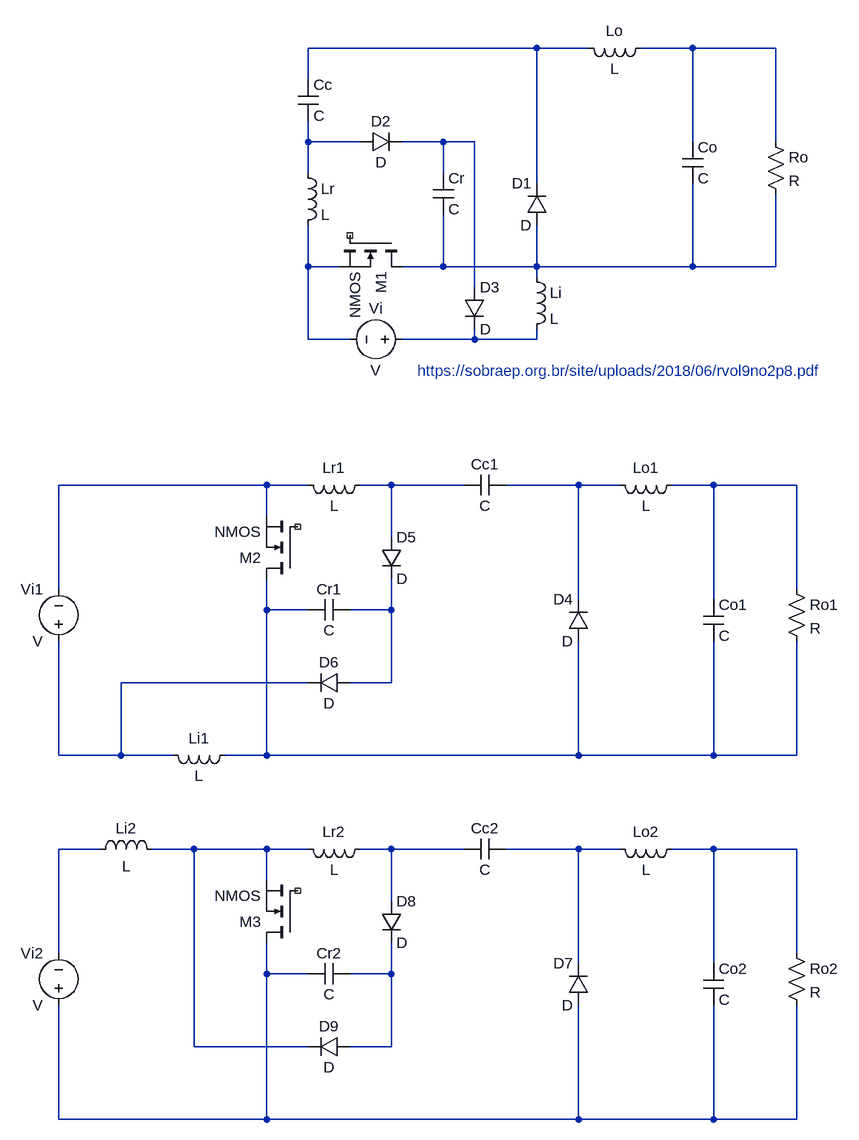
[diagram p0: schematic Draft1.asc]
Draft1.asc, the LTspice schematic file:
Version 4
SHEET 1 1072 1680
WIRE 480 -288 128 -288
WIRE 560 -288 480 -288
WIRE 720 -288 640 -288
WIRE 848 -288 720 -288
WIRE 128 -240 128 -288
WIRE 128 -144 128 -176
WIRE 208 -144 128 -144
WIRE 336 -144 272 -144
WIRE 384 -144 336 -144
WIRE 720 -144 720 -288
WIRE 848 -144 848 -288
WIRE 128 -96 128 -144
WIRE 336 -96 336 -144
WIRE 480 -80 480 -288
WIRE 128 48 128 -16
WIRE 176 48 128 48
WIRE 336 48 336 -32
WIRE 336 48 272 48
WIRE 480 48 480 -16
WIRE 480 48 336 48
WIRE 720 48 720 -80
WIRE 720 48 480 48
WIRE 848 48 848 -64
WIRE 848 48 720 48
WIRE 480 64 480 48
WIRE 384 80 384 -144
WIRE 128 160 128 48
WIRE 192 160 128 160
WIRE 384 160 384 144
WIRE 384 160 272 160
WIRE 480 160 480 144
WIRE 480 160 384 160
WIRE 64 384 -256 384
WIRE 128 384 64 384
WIRE 256 384 208 384
WIRE 368 384 256 384
WIRE 544 384 432 384
WIRE 608 384 544 384
WIRE 752 384 688 384
WIRE 880 384 752 384
WIRE 64 432 64 384
WIRE 256 464 256 384
WIRE -256 544 -256 384
WIRE 880 544 880 384
WIRE 544 560 544 384
WIRE 752 560 752 384
WIRE 64 576 64 528
WIRE 128 576 64 576
WIRE 256 576 256 528
WIRE 256 576 192 576
WIRE 128 688 -160 688
WIRE 256 688 256 576
WIRE 256 688 192 688
WIRE -256 800 -256 624
WIRE -160 800 -160 688
WIRE -160 800 -256 800
WIRE -80 800 -160 800
WIRE 64 800 64 576
WIRE 64 800 0 800
WIRE 544 800 544 624
WIRE 544 800 64 800
WIRE 752 800 752 624
WIRE 752 800 544 800
WIRE 880 800 880 624
WIRE 880 800 752 800
WIRE -192 944 -256 944
WIRE -48 944 -112 944
WIRE 64 944 -48 944
WIRE 128 944 64 944
WIRE 256 944 208 944
WIRE 368 944 256 944
WIRE 544 944 432 944
WIRE 608 944 544 944
WIRE 752 944 688 944
WIRE 880 944 752 944
WIRE 64 992 64 944
WIRE 256 1024 256 944
WIRE -256 1104 -256 944
WIRE 880 1104 880 944
WIRE 544 1120 544 944
WIRE 752 1120 752 944
WIRE 64 1136 64 1088
WIRE 128 1136 64 1136
WIRE 256 1136 256 1088
WIRE 256 1136 192 1136
WIRE -48 1248 -48 944
WIRE 128 1248 -48 1248
WIRE 256 1248 256 1136
WIRE 256 1248 192 1248
WIRE -256 1360 -256 1184
WIRE 64 1360 64 1136
WIRE 64 1360 -256 1360
WIRE 544 1360 544 1184
WIRE 544 1360 64 1360
WIRE 752 1360 752 1184
WIRE 752 1360 544 1360
WIRE 880 1360 880 1184
WIRE 880 1360 752 1360
SYMBOL voltage 288 160 R90
WINDOW 0 -32 56 VBottom 2
WINDOW 3 32 56 VTop 2
SYMATTR InstName Vi
SYMBOL diode 496 -16 R180
WINDOW 0 24 64 Left 2
WINDOW 3 24 0 Left 2
SYMATTR InstName D1
SYMBOL diode 208 -128 R270
WINDOW 0 32 32 VTop 2
WINDOW 3 0 32 VBottom 2
SYMATTR InstName D2
SYMBOL diode 368 80 R0
SYMATTR InstName D3
SYMBOL ind 464 48 R0
SYMATTR InstName Li
SYMBOL ind 656 -304 R90
WINDOW 0 5 56 VBottom 2
WINDOW 3 32 56 VTop 2
SYMATTR InstName Lo
SYMBOL cap 320 -96 R0
SYMATTR InstName Cr
SYMBOL ind 112 -112 R0
SYMATTR InstName Lr
SYMBOL cap 112 -240 R0
SYMATTR InstName Cc
SYMBOL nmos 272 0 R90
SYMATTR InstName M1
SYMBOL cap 704 -144 R0
SYMATTR InstName Co
SYMBOL res 832 -160 R0
SYMATTR InstName Ro
SYMBOL voltage -256 640 R180
WINDOW 0 24 96 Left 2
WINDOW 3 24 16 Left 2
SYMATTR InstName Vi1
SYMBOL diode 560 624 R180
WINDOW 0 24 64 Left 2
WINDOW 3 24 0 Left 2
SYMATTR InstName D4
SYMBOL diode 240 464 R0
SYMATTR InstName D5
SYMBOL diode 192 672 R90
WINDOW 0 0 32 VBottom 2
WINDOW 3 32 32 VTop 2
SYMATTR InstName D6
SYMBOL ind 16 784 R90
WINDOW 0 5 56 VBottom 2
WINDOW 3 32 56 VTop 2
SYMATTR InstName Li1
SYMBOL ind 704 368 R90
WINDOW 0 5 56 VBottom 2
WINDOW 3 32 56 VTop 2
SYMATTR InstName Lo1
SYMBOL cap 192 560 R90
WINDOW 0 0 32 VBottom 2
WINDOW 3 32 32 VTop 2
SYMATTR InstName Cr1
SYMBOL ind 224 368 R90
WINDOW 0 5 56 VBottom 2
WINDOW 3 32 56 VTop 2
SYMATTR InstName Lr1
SYMBOL cap 432 368 R90
WINDOW 0 0 32 VBottom 2
WINDOW 3 32 32 VTop 2
SYMATTR InstName Cc1
SYMBOL nmos 112 528 R180
SYMATTR InstName M2
SYMBOL cap 736 560 R0
SYMATTR InstName Co1
SYMBOL res 864 528 R0
SYMATTR InstName Ro1
SYMBOL voltage -256 1200 R180
WINDOW 0 24 96 Left 2
WINDOW 3 24 16 Left 2
SYMATTR InstName Vi2
SYMBOL diode 560 1184 R180
WINDOW 0 24 64 Left 2
WINDOW 3 24 0 Left 2
SYMATTR InstName D7
SYMBOL diode 240 1024 R0
SYMATTR InstName D8
SYMBOL diode 192 1232 R90
WINDOW 0 0 32 VBottom 2
WINDOW 3 32 32 VTop 2
SYMATTR InstName D9
SYMBOL ind -208 960 R270
WINDOW 0 32 56 VTop 2
WINDOW 3 5 56 VBottom 2
SYMATTR InstName Li2
SYMBOL ind 704 928 R90
WINDOW 0 5 56 VBottom 2
WINDOW 3 32 56 VTop 2
SYMATTR InstName Lo2
SYMBOL cap 192 1120 R90
WINDOW 0 0 32 VBottom 2
WINDOW 3 32 32 VTop 2
SYMATTR InstName Cr2
SYMBOL ind 224 928 R90
WINDOW 0 5 56 VBottom 2
WINDOW 3 32 56 VTop 2
SYMATTR InstName Lr2
SYMBOL cap 432 928 R90
WINDOW 0 0 32 VBottom 2
WINDOW 3 32 32 VTop 2
SYMATTR InstName Cc2
SYMBOL nmos 112 1088 R180
SYMATTR InstName M3
SYMBOL cap 736 1120 R0
SYMATTR InstName Co2
SYMBOL res 864 1088 R0
SYMATTR InstName Ro2
TEXT 296 208 Left 2 ;https://sobraep.org.br/site/uploads/2018/06/rvol9no2p8.pdf

The netlist it stands for:
* Draft1.asc
Vi N007 N005 V
D1 N006 N001 D
D2 N003 N004 D
D3 N004 N007 D
Li N006 N007 L
Lo N002 N001 L
Cr N004 N006 C
Lr N003 N005 L
Cc N001 N003 C
M1 N006 NC_01 N005 N005 NMOS
Co N002 N006 C
Ro N002 N006 R
Vi1 N014 N008 V
D4 N012 N010 D
D5 N009 N013 D
D6 N013 N014 D
Li1 N012 N014 L
Lo1 N011 N010 L
Cr1 N013 N012 C
Lr1 N009 N008 L
Cc1 N010 N009 C
M2 N012 NC_02 N008 N008 NMOS
Co1 N011 N012 C
Ro1 N011 N012 R
Vi2 N020 N015 V
D7 N020 N018 D
D8 N017 N021 D
D9 N021 N016 D
Li2 N015 N016 L
Lo2 N019 N018 L
Cr2 N021 N020 C
Lr2 N017 N016 L
Cc2 N018 N017 C
M3 N020 NC_03 N016 N016 NMOS
Co2 N019 N020 C
Ro2 N019 N020 R
.model D D
.lib standard.dio
.model NMOS NMOS
.model PMOS PMOS
.lib standard.mos
* https://sobraep.org.br/site/uploads/2018/06/rvol9no2p8.pdf
.backanno
.end